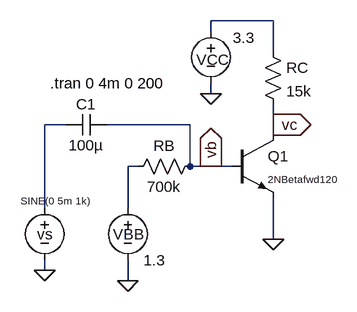
[diagram p0: schematic prob6_04.asc]
prob6_04.asc, the LTspice schematic file:
Version 4
SHEET 1 880 680
WIRE 256 -64 160 -64
WIRE 160 -48 160 -64
WIRE 256 -16 256 -64
WIRE 160 48 160 32
WIRE -64 96 -96 96
WIRE 128 96 0 96
WIRE 256 96 256 64
WIRE 256 112 256 96
WIRE 48 160 32 160
WIRE 128 160 128 96
WIRE 160 160 128 160
WIRE 192 160 160 160
WIRE -96 224 -96 96
WIRE 32 224 32 160
WIRE 256 272 256 208
WIRE -96 320 -96 304
WIRE 32 336 32 304
FLAG 160 48 0
FLAG 32 336 0
FLAG 256 272 0
FLAG 256 96 vc
IOPIN 256 96 Out
FLAG 160 160 vb
IOPIN 160 160 Out
FLAG -96 320 0
SYMBOL npn 192 112 R0
WINDOW 3 56 68 Left 1
SYMATTR InstName Q1
SYMATTR Value 2NBetafwd120
SYMBOL voltage -96 208 R0
WINDOW 0 -12 56 Left 2
WINDOW 3 -37 5 Left 1
WINDOW 123 0 0 Left 0
WINDOW 39 -142 31 Left 1
SYMATTR InstName vs
SYMATTR Value SINE(0 5m 1k)
SYMBOL voltage 160 -64 R0
WINDOW 0 -22 60 Left 2
WINDOW 3 34 26 Left 2
SYMATTR InstName VCC
SYMATTR Value 3.3
SYMBOL voltage 32 208 R0
WINDOW 0 -23 56 Left 2
SYMATTR InstName VBB
SYMATTR Value 1.3
SYMBOL res 240 -32 R0
SYMATTR InstName RC
SYMATTR Value 15k
SYMBOL res 144 144 R90
WINDOW 0 0 56 VBottom 2
WINDOW 3 32 56 VTop 2
SYMATTR InstName RB
SYMATTR Value 700k
SYMBOL cap 0 80 R90
WINDOW 0 0 32 VBottom 2
WINDOW 3 32 32 VTop 2
SYMATTR InstName C1
SYMATTR Value 100µ
TEXT -88 32 Left 2 !.tran 0 4m 0 200

The netlist it stands for:
* prob6_04.asc
Q1 vc vb 0 0 2NBetafwd120
vs N002 0 SINE(0 5m 1k)
VCC N001 0 3.3
VBB N003 0 1.3
RC N001 vc 15k
RB vb N003 700k
C1 vb N002 100µ
.model NPN NPN
.model PNP PNP
.lib standard.bjt
.tran 0 4m 0 200
.backanno
.end